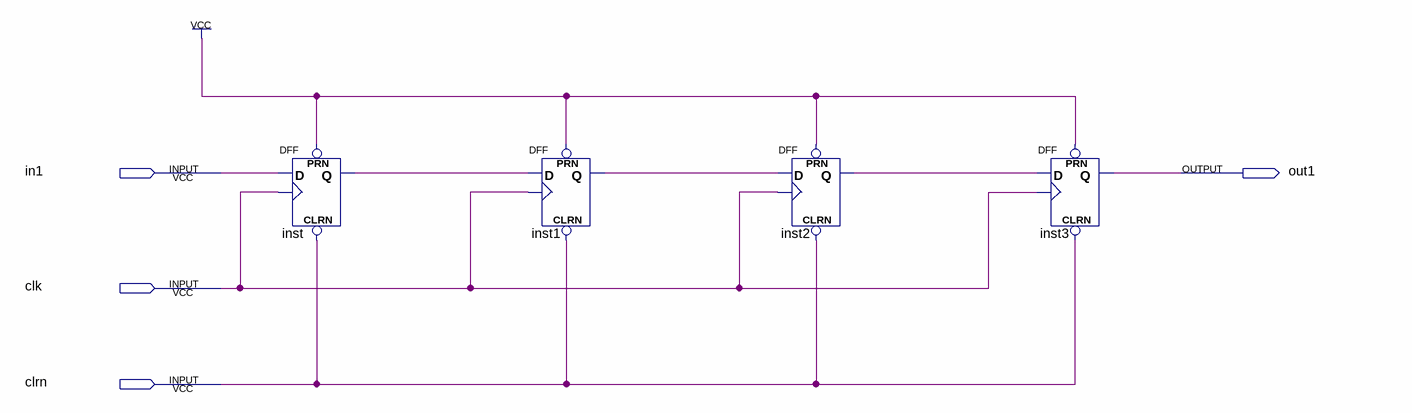
[diagram p0: schematic sheet]
// Quartus schematic ShiftRegisterSISO_4bit.bdf as structural Verilog: 4 symbols, 4 pins
module ShiftRegisterSISO_4bit (
  input  in1,
  input  clk,
  input  clrn,
  output out1
);

  wire inst1_q, inst2_q, inst_q;

  DFF inst (.CLRN(clrn), .CLK(clk), .D(in1), .PRN(1'b1), .Q(inst_q));
  DFF inst1 (.CLRN(clrn), .CLK(clk), .D(inst_q), .PRN(1'b1), .Q(inst1_q));
  DFF inst2 (.CLRN(clrn), .CLK(clk), .D(inst1_q), .PRN(1'b1), .Q(inst2_q));
  DFF inst3 (.CLRN(clrn), .CLK(clk), .D(inst2_q), .PRN(1'b1), .Q(out1));
endmodule
